# Altium schematic sheet mcu.SchDoc: PIC18F66K22 Microcontroller
size A4; Author: AJ; DrawnBy: AJ; Engineer: AJ; DocumentNumber: 3; Revision: 003; SheetNumber: 3; SheetTotal: 6
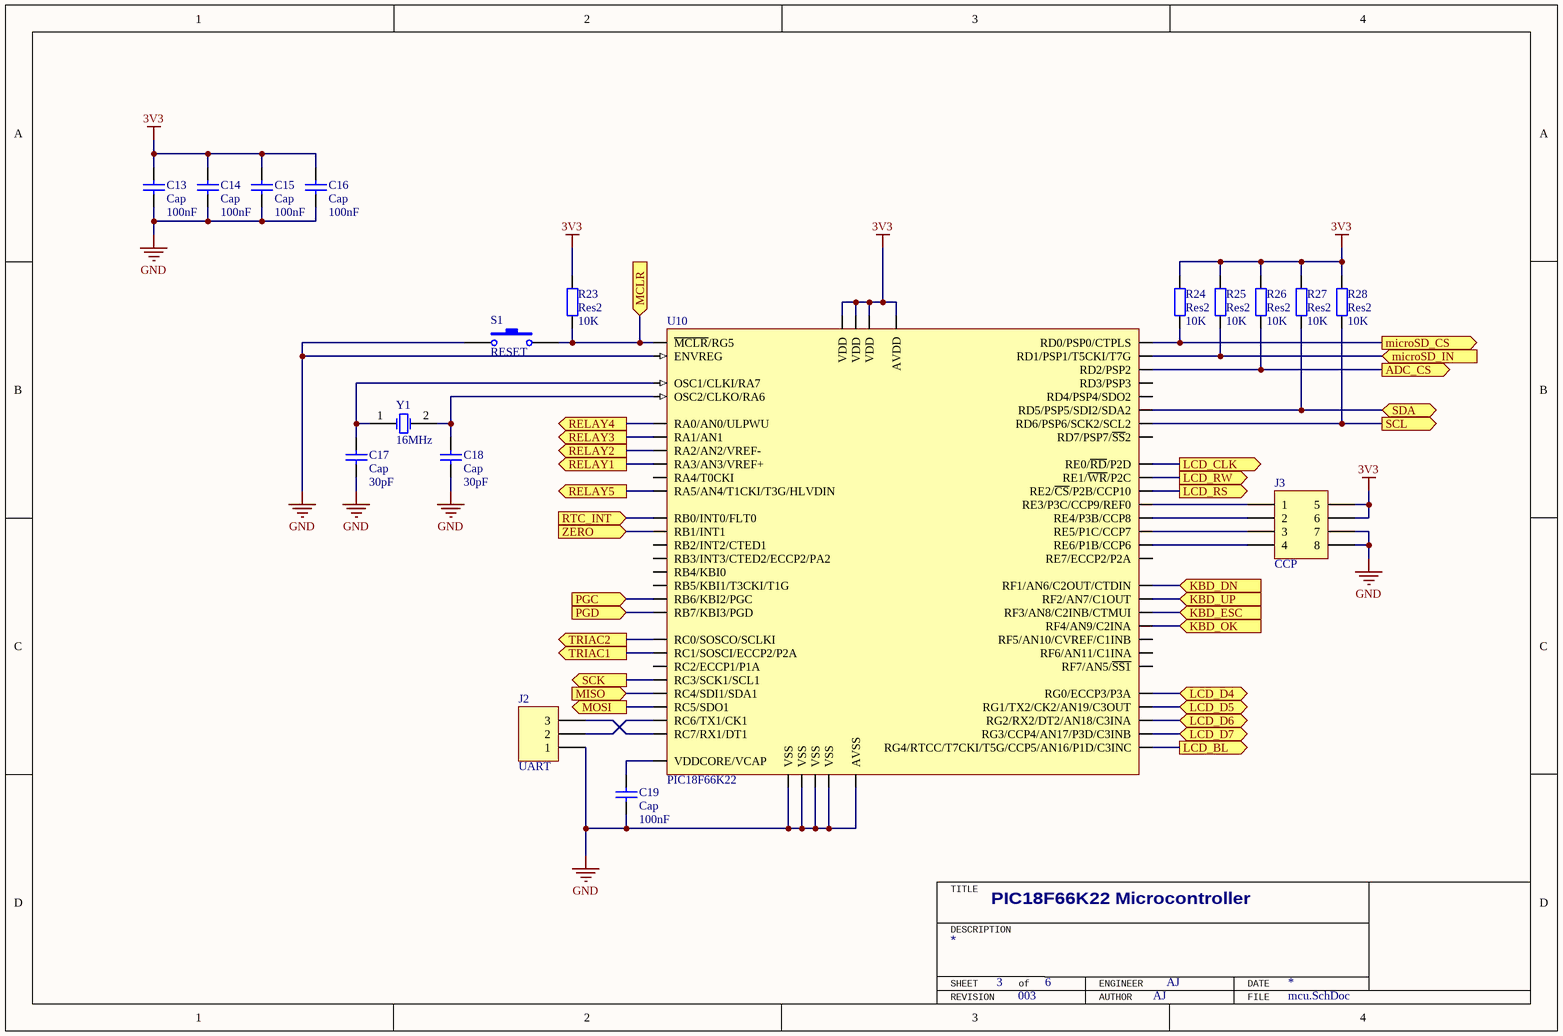
[diagram p0: mcu.SchDoc]

## Parts
C13  Cap  value 100nF  [0603]
C14  Cap  value 100nF  [0603]
C15  Cap  value 100nF  [0603]
C16  Cap  value 100nF  [0603]
C17  Cap  value 30pF  [0603]
C18  Cap  value 30pF  [0603]
C19  Cap  value 100nF  [0603]
J2  UART  [HDR1X3]
J3  CCP  [HDR2X4_CEN]
R23  Res2  value 10K  [0603]
R24  Res2  value 10K  [0603]
R25  Res2  value 10K  [0603]
R26  Res2  value 10K  [0603]
R27  Res2  value 10K  [0603]
R28  Res2  value 10K  [0603]
S1  RESET  [Switch 2]
U10  PIC18F66K22  [TQFP-64]
Y1  16MHz  [XTAL]

## Ports
ADC_CS (out), KBD_DN (in), KBD_ESC (in), KBD_OK (in), KBD_UP (in), LCD_BL (out), LCD_CLK (out), LCD_D4 (bidir), LCD_D5 (bidir), LCD_D6 (bidir), LCD_D7 (bidir), LCD_RS (out), LCD_RW (out), MCLR (in), microSD_CS (out), microSD_IN (in), MISO (in), MOSI (out), PGC (in), PGD (in), RELAY1 (out), RELAY2 (out), RELAY3 (out), RELAY4 (out), RELAY5 (out), RTC_INT (in), SCK (out), SCL (out), SDA (bidir), TRIAC1 (out), TRIAC2 (out), ZERO (in)

## Nets
3V3: C13.2 C14.2 C15.2 C16.2 J3.5 J3.6 R23.2 R24.2 R25.2 R26.2 R27.2 R28.2 U10.19(AVDD) U10.26(VDD) U10.38(VDD) U10.57(VDD)
GND: C13.1 C14.1 C15.1 C16.1 C17.1 C18.1 C19.1 J2.1 J3.7 J3.8 S1.1 U10.9(VSS) U10.18(ENVREG) U10.20(AVSS) U10.25(VSS) U10.41(VSS) U10.56(VSS)
ADC_CS: R26.1 U10.54(RD2/PSP2) ; port ADC_CS
KBD_DN: U10.17(RF1/AN6/C2OUT/CTDIN) ; port KBD_DN
KBD_ESC: U10.15(RF3/AN8/C2INB/CTMUI) ; port KBD_ESC
KBD_OK: U10.14(RF4/AN9/C2INA) ; port KBD_OK
KBD_UP: U10.16(RF2/AN7/C1OUT) ; port KBD_UP
LCD_BL: U10.8(RG4/RTCC/T7CKI/T5G/CCP5/AN16/P1D/C3INC) ; port LCD_BL
LCD_CLK: U10.2(RE0/~{RD}/P2D) ; port LCD_CLK
LCD_D4: U10.3(RG0/ECCP3/P3A) ; port LCD_D4
LCD_D5: U10.4(RG1/TX2/CK2/AN19/C3OUT) ; port LCD_D5
LCD_D6: U10.5(RG2/RX2/DT2/AN18/C3INA) ; port LCD_D6
LCD_D7: U10.6(RG3/CCP4/AN17/P3D/C3INB) ; port LCD_D7
LCD_RS: U10.64(RE2/~{CS}/P2B/CCP10) ; port LCD_RS
LCD_RW: U10.1(RE1/~{WR}/P2C) ; port LCD_RW
MCLR: R23.1 S1.2 U10.7(~{MCLR}/RG5) ; port MCLR
microSD_CS: R24.1 U10.58(RD0/PSP0/CTPLS) ; port microSD_CS
microSD_IN: R25.1 U10.55(RD1/PSP1/T5CKI/T7G) ; port microSD_IN
MISO: U10.35(RC4/SDI1/SDA1) ; port MISO
MOSI: U10.36(RC5/SDO1) ; port MOSI
PGC: U10.42(RB6/KBI2/PGC) ; port PGC
PGD: U10.37(RB7/KBI3/PGD) ; port PGD
RELAY1: U10.21(RA3/AN3/VREF+) ; port RELAY1
RELAY2: U10.22(RA2/AN2/VREF-) ; port RELAY2
RELAY3: U10.23(RA1/AN1) ; port RELAY3
RELAY4: U10.24(RA0/AN0/ULPWU) ; port RELAY4
RELAY5: U10.27(RA5/AN4/T1CKI/T3G/HLVDIN) ; port RELAY5
RTC_INT: U10.48(RB0/INT0/FLT0) ; port RTC_INT
SCK: U10.34(RC3/SCK1/SCL1) ; port SCK
SCL: R28.1 U10.50(RD6/PSP6/SCK2/SCL2) ; port SCL
SDA: R27.1 U10.51(RD5/PSP5/SDI2/SDA2) ; port SDA
TRIAC1: U10.29(RC1/SOSCI/ECCP2/P2A) ; port TRIAC1
TRIAC2: U10.30(RC0/SOSCO/SCLKI) ; port TRIAC2
ZERO: U10.47(RB1/INT1) ; port ZERO
NetC17_2: C17.2 U10.39(OSC1/CLKI/RA7) Y1.1(OSC1)
NetC18_2: C18.2 U10.40(OSC2/CLKO/RA6) Y1.2(OSC2)
NetC19_2: C19.2 U10.10(VDDCORE/VCAP)
NetJ2_2: J2.2 U10.31(RC6/TX1/CK1)
NetJ2_3: J2.3 U10.32(RC7/RX1/DT1)
NetJ3_1: J3.1 U10.63(RE3/P3C/CCP9/REF0)
NetJ3_2: J3.2 U10.62(RE4/P3B/CCP8)
NetJ3_3: J3.3 U10.61(RE5/P1C/CCP7)
NetJ3_4: J3.4 U10.60(RE6/P1B/CCP6)

Not connected (* = marked no-connect by the designer): U10 11(RF7/AN5/~{SS1}) 12(RF6/AN11/C1INA) 13(RF5/AN10/CVREF/C1INB) 28(RA4/T0CKI) 33(RC2/ECCP1/P1A) 43(RB5/KBI1/T3CKI/T1G) 44(RB4/KBI0) 45(RB3/INT3/CTED2/ECCP2/PA2) 46(RB2/INT2/CTED1) 49(RD7/PSP7/~{SS}2) 52(RD4/PSP4/SDO2) 53(RD3/PSP3) 59(RE7/ECCP2/P2A)

## Notes on the sheet
- TITLE
- DESCRIPTION
- SHEET
- of
- ENGINEER
- DATE
- REVISION
- AUTHOR
- FILE

## Library data of the parts
C13-C19 = Cap: Capacitor; Published: 8-Jun-2000; LatestRevisionDate: 17-Jul-2002; LatestRevisionNote: Re-released for DXP Platform.; PackageReference: RAD-0.3; Publisher: Altium Limited
J2 = Header 3: Header, 3-Pin; LatestRevisionDate: 17-Jul-2002; LatestRevisionNote: Re-released for DXP Platform.; Publisher: Altium Limited
J3 = Header 4X2A: Header, 4-Pin, Dual row; LatestRevisionDate: 17-Jul-2002; LatestRevisionNote: Re-released for DXP Platform.; Publisher: Altium Limited
R23-R28 = Res2: Resistor; Published: 8-Jun-2000; LatestRevisionDate: 17-Jul-2002; LatestRevisionNote: Re-released for DXP Platform.; PackageReference: AXIAL-0.4; Publisher: Altium Limited
S1 = SW-PB: Switch; Published: 24-Mar-1999; LatestRevisionDate: 17-Jul-2002; LatestRevisionNote: Re-released for DXP Platform.; PackageReference: SPST-2; Publisher: Altium Limited
U10 = PIC18F66K22: PIC microcontroller
Y1 = XTAL: Crystal Oscillator; Published: 8-Jun-2000; LatestRevisionDate: 17-Jul-2002; LatestRevisionNote: Re-released for DXP Platform.; PackageReference: R38; Publisher: Altium Limited